# Altium schematic sheet car_sheet.SchDoc
size A2
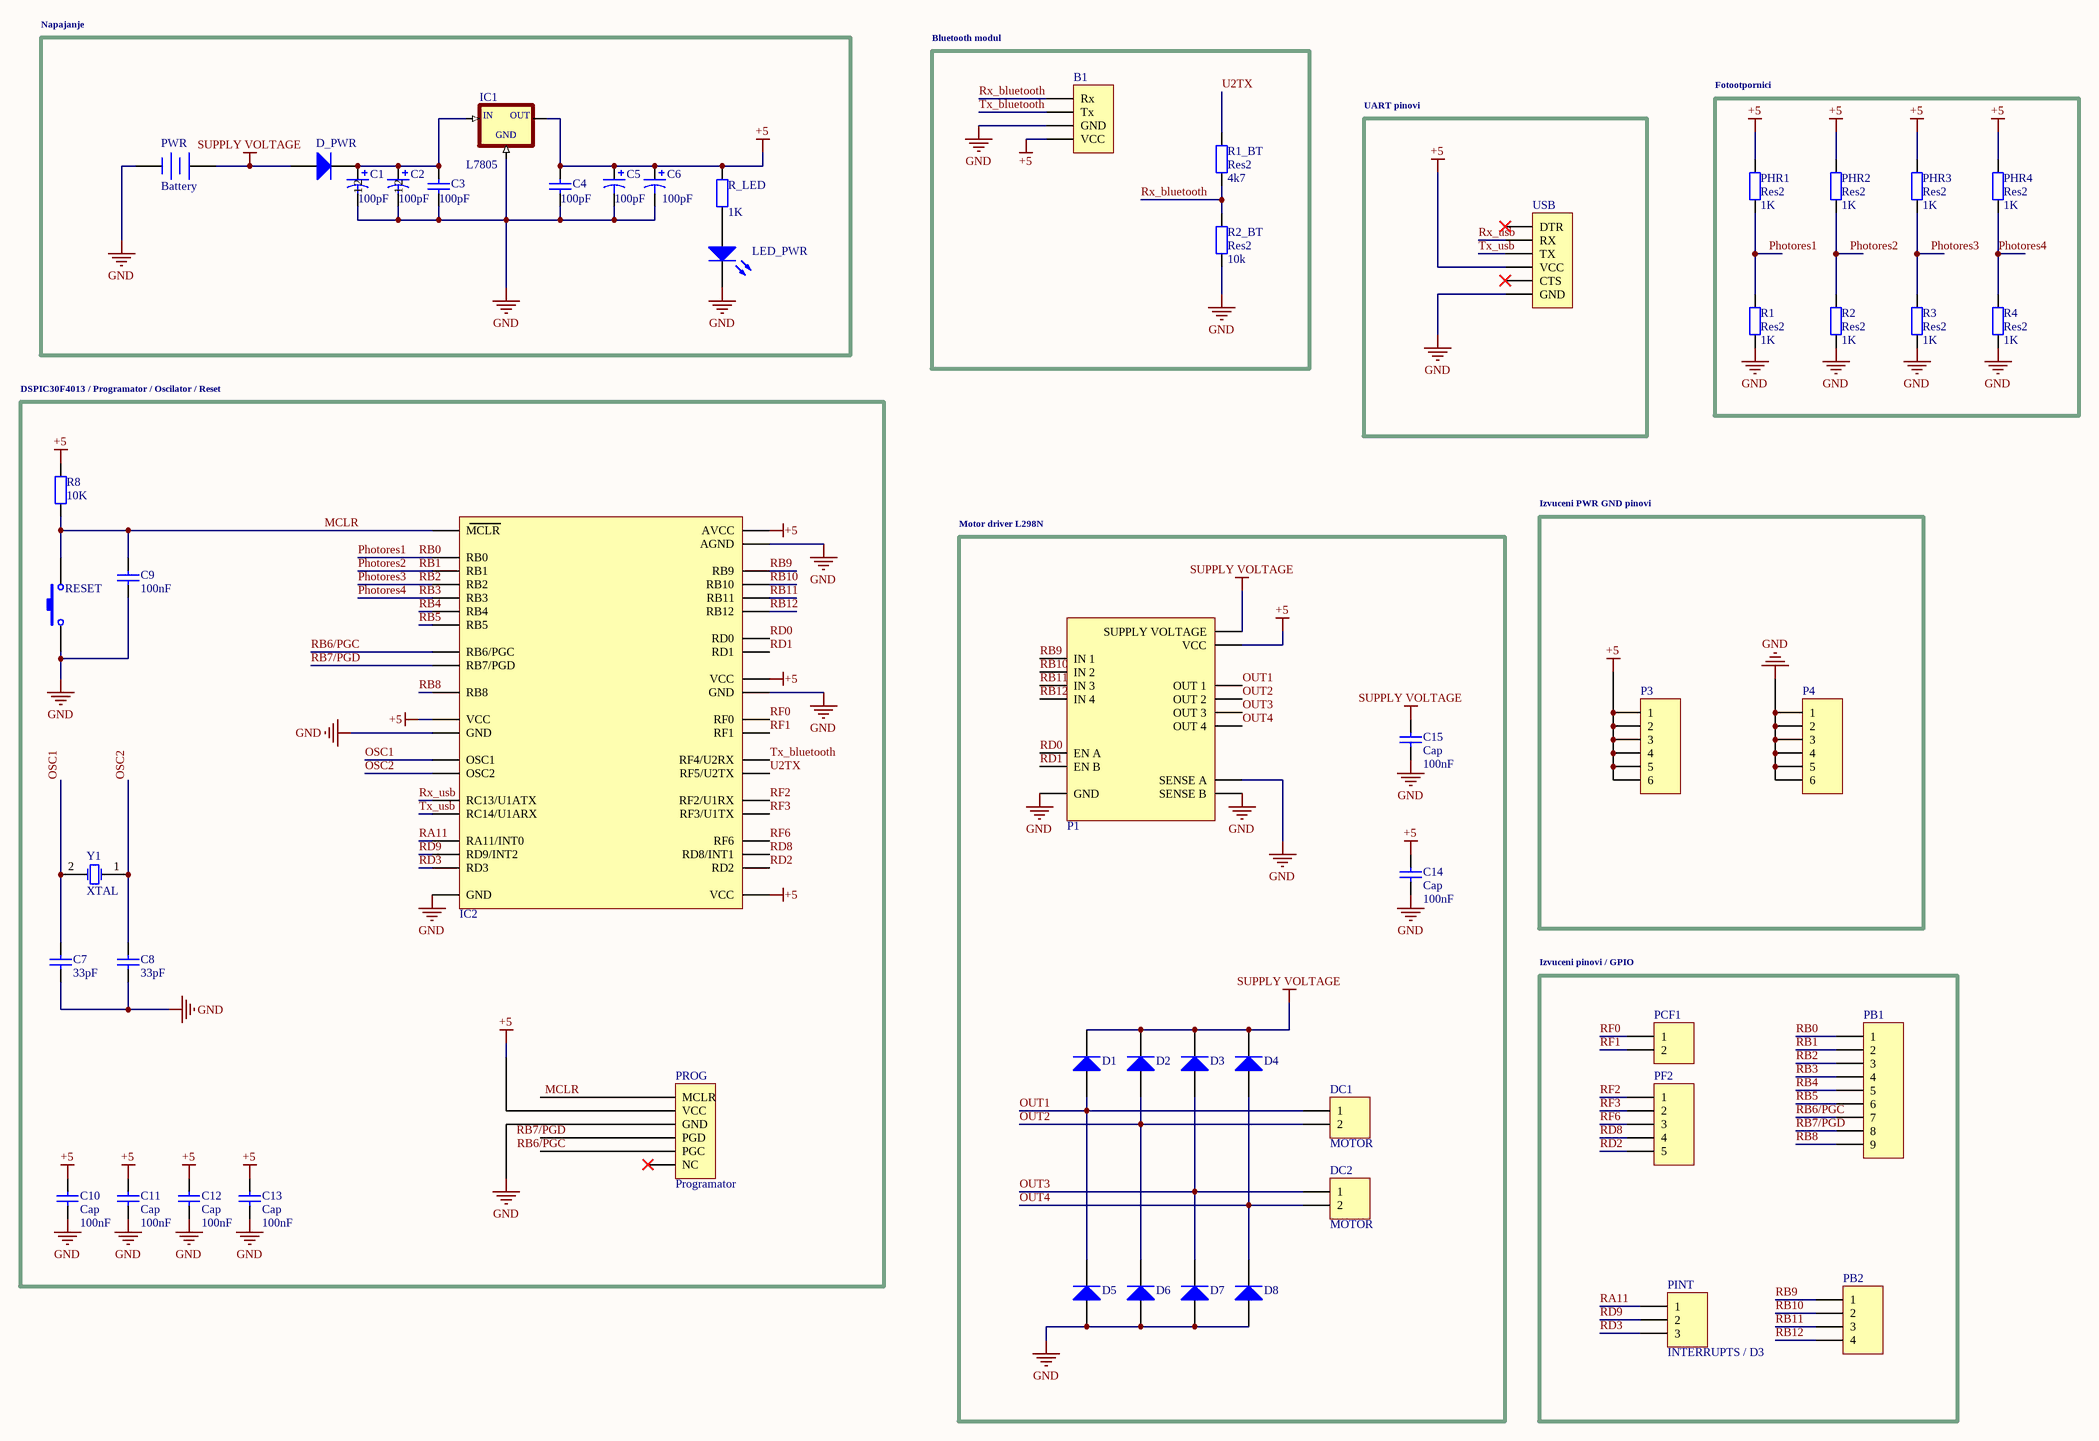
[diagram p0: car_sheet.SchDoc]

## Parts
B1  (no value)  [HDR1X4]
C1  value 100pF  [POL_CAP]
C2  value 100pF  [POL_CAP]
C3  value 100pF  [RAD-0.3]
C4  value 100pF  [RAD-0.3]
C5  value 100pF  [POL_CAP]
C6  value 100pF  [POL_CAP]
C7  value 33pF  [RAD-0.3]  (hidden comment: Cap)
C8  value 33pF  [RAD-0.3]  (hidden comment: Cap)
C9  value 100nF  [RAD-0.3]  (hidden comment: Cap)
C10  Cap  value 100nF  [RAD-0.3]
C11  Cap  value 100nF  [RAD-0.3]
C12  Cap  value 100nF  [RAD-0.3]
C13  Cap  value 100nF  [RAD-0.3]
C14  Cap  value 100nF  [RAD-0.3]
C15  Cap  value 100nF  [RAD-0.3]
D1  Diode 1N914  [DO-35]  (value not drawn)
D2  Diode 1N914  [DO-35]  (value not drawn)
D3  Diode 1N914  [DO-35]  (value not drawn)
D4  Diode 1N914  [DO-35]  (value not drawn)
D5  Diode 1N914  [DO-35]  (value not drawn)
D6  Diode 1N914  [DO-35]  (value not drawn)
D7  Diode 1N914  [DO-35]  (value not drawn)
D8  Diode 1N914  [DO-35]  (value not drawn)
D_PWR  (no value)  [DO-41]
DC1  MOTOR  [HDR1X2]
DC2  MOTOR  [HDR1X2]
IC1  L7805  [TO-220FP_STM]
IC2  dsPIC30F4013  [PDIP40_600MC_MCH]  (value not drawn)
LED_PWR  (no value)  [HDR1X2]
P1  L298N  [Multiwatt15_V_STM]  (value not drawn)
P3  (no value)  [HDR1X6]
P4  (no value)  [HDR1X6]
PB1  (no value)  [HDR1X9]
PB2  (no value)  [HDR1X4]
PCF1  (no value)  [HDR1X2]
PF2  (no value)  [HDR1X5]
PHR1  Res2  value 1K  [AXIAL-0.4]
PHR2  Res2  value 1K  [AXIAL-0.4]
PHR3  Res2  value 1K  [AXIAL-0.4]
PHR4  Res2  value 1K  [AXIAL-0.4]
PINT  INTERRUPTS / D3  [HDR1X3]
PROG  Programator  [HDR1X6]
PWR  Battery  [BAT-2]
R1  Res2  value 1K  [AXIAL-0.4]
R1_BT  Res2  value 4k7  [AXIAL-0.4]
R2  Res2  value 1K  [AXIAL-0.4]
R2_BT  Res2  value 10k  [AXIAL-0.4]
R3  Res2  value 1K  [AXIAL-0.4]
R4  Res2  value 1K  [AXIAL-0.4]
R8  value 10K  [AXIAL-0.4]  (hidden comment: Res2)
R_LED  value 1K  [AXIAL-0.4]
RESET  SW-PB  [SPST-2]  (value not drawn)
USB  (no value)  [HDR1X6]
Y1  XTAL  [R38]

## Blocks framed on the sheet
Napajanje: C1-C6 D_PWR IC1 LED_PWR PWR R_LED
Bluetooth modul: B1 R1_BT R2_BT
UART pinovi: USB
Fotootpornici: PHR1-PHR4 R1-R4
DSPIC30F4013 / Programator / Oscilator / Reset: C7-C13 IC2 PROG R8 RESET Y1
Motor driver L298N: C14 C15 D1-D8 DC1 DC2 P1
Izvuceni PWR GND pinovi: P3 P4
Izvuceni pinovi / GPIO: PB1 PB2 PCF1 PF2 PINT

## Nets
+5: B1.4(VCC) C4.2 C5.1 C6.1 C10.1 C11.2 C12.2 C13.2 C14.2 IC1.3(OUT) IC2.11(VCC) IC2.21(VCC) IC2.32(VCC) IC2.40(AVCC) P1.9(VCC) P3.1 P3.2 P3.3 P3.4 P3.5 P3.6 PHR1.2 PHR2.2 PHR3.2 PHR4.2 PROG.2(VCC) R8.2 R_LED.2 USB.4(VCC)
GND: B1.3(GND) C1.2 C2.2 C3.1 C4.1 C5.2 C6.2 C7.1 C8.1 C9.2 C10.2 C11.1 C12.1 C13.1 C14.1 C15.1 D5.1(A) D6.1(A) D7.1(A) D8.1(A) IC1.2(GND) IC2.12(GND) IC2.20(GND) IC2.31(GND) IC2.39(AGND) LED_PWR.2(K) P1.1(SENSE_A) P1.8(GND) P1.15(SENSE_B) P4.1 P4.2 P4.3 P4.4 P4.5 P4.6 PROG.3(GND) PWR.2(-) R1.1 R2.1 R2_BT.1 R3.1 R4.1 RESET.1 USB.6(GND)
SUPPLY VOLTAGE: C15.2 D1.2(K) D2.2(K) D3.2(K) D4.2(K) D_PWR.1(A) P1.4(SUPPLY_VOLTAGE) PWR.1(+)
MCLR: C9.1 IC2.1(MCLR) PROG.1(MCLR) R8.1 RESET.2
OSC1: C7.2 IC2.13(OSC1) Y1.2(OSC2)
OSC2: C8.2 IC2.14(OSC2) Y1.1(OSC1)
OUT1: D1.1(A) D5.2(K) DC1.1 P1.2(OUT_1)
OUT2: D2.1(A) D6.2(K) DC1.2 P1.3(OUT_2)
OUT3: D3.1(A) D7.2(K) DC2.1 P1.13(OUT_3)
OUT4: D4.1(A) D8.2(K) DC2.2 P1.14(OUT_4)
Photores1: IC2.2(RB0) PB1.1 PHR1.1 R1.2  [also labelled RB0]
Photores2: IC2.3(RB1) PB1.2 PHR2.1 R2.2  [also labelled RB1]
Photores3: IC2.4(RB2) PB1.3 PHR3.1 R3.2  [also labelled RB2]
Photores4: IC2.5(RB3) PB1.4 PHR4.1 R4.2  [also labelled RB3]
RA11: IC2.17(RA11/INT0) PINT.1
RB4: IC2.6(RB4) PB1.5
RB5: IC2.7(RB5) PB1.6
RB6/PGC: IC2.8(RB6/PGC) PB1.7 PROG.5(PGC)
RB7/PGD: IC2.9(RB7/PGD) PB1.8 PROG.4(PGD)
RB8: IC2.10(RB8) PB1.9
RB9: IC2.38(RB9) P1.5(IN_1) PB2.1
RB10: IC2.37(RB10) P1.7(IN_2) PB2.2
RB11: IC2.36(RB11) P1.10(IN_3) PB2.3
RB12: IC2.35(RB12) P1.12(IN_4) PB2.4
RD0: IC2.34(RD0) P1.6(EN_A)
RD1: IC2.33(RD1) P1.11(EN_B)
RD2: IC2.22(RD2) PF2.5
RD3: IC2.19(RD3) PINT.3
RD8: IC2.23(RD8/INT1) PF2.4
RD9: IC2.18(RD9/INT2) PINT.2
RF0: IC2.30(RF0) PCF1.1
RF1: IC2.29(RF1) PCF1.2
RF2: IC2.26(RF2/U1RX) PF2.1
RF3: IC2.25(RF3/U1TX) PF2.2
RF6: IC2.24(RF6) PF2.3
Rx_bluetooth: B1.1(Rx) R1_BT.1 R2_BT.2
Rx_usb: IC2.15(RC13/U1ATX) USB.2(RX)
Tx_bluetooth: B1.2(Tx) IC2.28(RF4/U2RX)
Tx_usb: IC2.16(RC14/U1ARX) USB.3(TX)
U2TX: IC2.27(RF5/U2TX) R1_BT.2
NetC1_1: C1.1 C2.1 C3.2 D_PWR.2(K) IC1.1(IN)
NetLED_PWR_1: LED_PWR.1(A) R_LED.1

Not connected (* = marked no-connect by the designer): PROG 6(NC)*; USB 1(DTR)* 5(CTS)*

## Library data of the parts
B1 PB2 = Header 4: Header, 4-Pin; LatestRevisionDate: 17-Jul-2002; LatestRevisionNote: Re-released for DXP Platform.; Publisher: Altium Limited
C1 C2 C5 C6 = Cap Pol1: Polarized Capacitor (Radial); Published: 8-Jun-2000; LatestRevisionDate: 17-Jul-2002; LatestRevisionNote: Re-released for DXP Platform.; PackageReference: RB7.6-15; Publisher: Altium Limited; PackageDescription: Polarized Capacitor (Radial); 2 Leads
C3 C4 C7-C15 = Cap: Capacitor; Published: 8-Jun-2000; LatestRevisionDate: 17-Jul-2002; LatestRevisionNote: Re-released for DXP Platform.; PackageReference: RAD-0.3; Publisher: Altium Limited; PackageDescription: Radial Cap, Thru-Hole; 2 Leads; 0.3 in Pin Spacing
D1-D8 = Diode 1N914: High Conductance Fast Diode; Published: 8-Jun-2000; LatestRevisionDate: 17-Jul-2002; LatestRevisionNote: Re-released for DXP Platform.; DatasheetVersion: 1997; PackageReference: DO-35; Publisher: Altium Limited; PackageDescription: Diode, Axial; Body 3.8 x 1.9 mm (LxDia. max), Lead Dia. 0.53 mm (max); Code_JEDEC: DO-204-AH; ComponentLink1Description: Manufacturer Link; ComponentLink1URL: http://www.fairchildsemi.com/; ComponentLink2Description: Datasheet; ComponentLink2URL: http://www.fairchildsemi.com/ds/1N%2F1N4448.pdf
D_PWR = Diode 1N4007: 1 Amp General Purpose Rectifier; Published: 8-Jun-2000; LatestRevisionDate: 17-Jul-2002; LatestRevisionNote: Re-released for DXP Platform.; DatasheetVersion: 1998; PackageReference: DO-41; Publisher: Altium Limited; PackageDescription: Diode, Axial; Body 5.2 x 2.7 mm (LxDia. max), Lead Dia. 0.86 mm (max); Code_JEDEC: DO-204-AL; ComponentLink1Description: Manufacturer Link; ComponentLink1URL: http://www.fairchildsemi.com/; ComponentLink2Description: Datasheet; ComponentLink2URL: http://www.fairchildsemi.com/ds/1N%2F1N4001.pdf; PackageVersion: Aug-1999
DC1 DC2 PCF1 = Header 2: Header, 2-Pin; LatestRevisionDate: 17-Jul-2002; LatestRevisionNote: Re-released for DXP Platform.; Publisher: Altium Limited
IC1 = L7805: Linear Voltage Regulator IC 1 Output 1.5A D2PAK; MF: STMicroelectronics; Package: TO-263-3 Inchange Semiconductor; Availability: Unavailable; MP: L7805; Value: *; SnapEDA_Link: https://www.snapeda.com/parts/L7805/STMicroelectronics/view-part/563125/?ref=snap; Price: None
IC2 = IC_40
LED_PWR = LED1: Typical RED GaAs LED; Published: 8-Jun-2000; LatestRevisionDate: 08-Jul-2005; LatestRevisionNote: Mech Layer 1 removed.; PackageReference: LED-1; Publisher: Altium Limited; PackageDescription: LED; 2 Leads
P3 P4 PROG USB = Header 6: Header, 6-Pin; LatestRevisionDate: 17-Jul-2002; LatestRevisionNote: Re-released for DXP Platform.; Publisher: Altium Limited
PB1 = Header 9: Header, 9-Pin; LatestRevisionDate: 17-Jul-2002; LatestRevisionNote: Re-released for DXP Platform.; Publisher: Altium Limited
PF2 = Header 5: Header, 5-Pin; LatestRevisionDate: 17-Jul-2002; LatestRevisionNote: Re-released for DXP Platform.; Publisher: Altium Limited
PHR1-PHR4 R1 R1_BT R2 R2_BT R3 R4 R8 R_LED = Res2: Resistor; Published: 8-Jun-2000; LatestRevisionDate: 17-Jul-2002; LatestRevisionNote: Re-released for DXP Platform.; PackageReference: AXIAL-0.4; Publisher: Altium Limited; PackageDescription: Axial Device, Thru-Hole; 2 Leads; 0.4 in Pin Spacing
PINT = Header 3: Header, 3-Pin; LatestRevisionDate: 17-Jul-2002; LatestRevisionNote: Re-released for DXP Platform.; Publisher: Altium Limited
PWR = Battery: Multicell Battery; Published: 24-Mar-1999; LatestRevisionDate: 17-Jul-2002; LatestRevisionNote: Re-released for DXP Platform.; PackageReference: BAT-2; Publisher: Altium Limited; PackageDescription: Battery; 2 Leads
RESET = SW-PB: Switch; Published: 24-Mar-1999; LatestRevisionDate: 17-Jul-2002; LatestRevisionNote: Re-released for DXP Platform.; PackageReference: SPST-2; Publisher: Altium Limited; PackageDescription: Switch; 2 Leads
Y1 = XTAL: Crystal Oscillator; Published: 8-Jun-2000; LatestRevisionDate: 17-Jul-2002; LatestRevisionNote: Re-released for DXP Platform.; PackageReference: R38; Publisher: Altium Limited; PackageDescription: Crystal, Thru-Hole; 2 Leads; Body 3.1 x 8.2 mm (Dia.xH)